# EAGLE design mega (EAGLE 4.16)
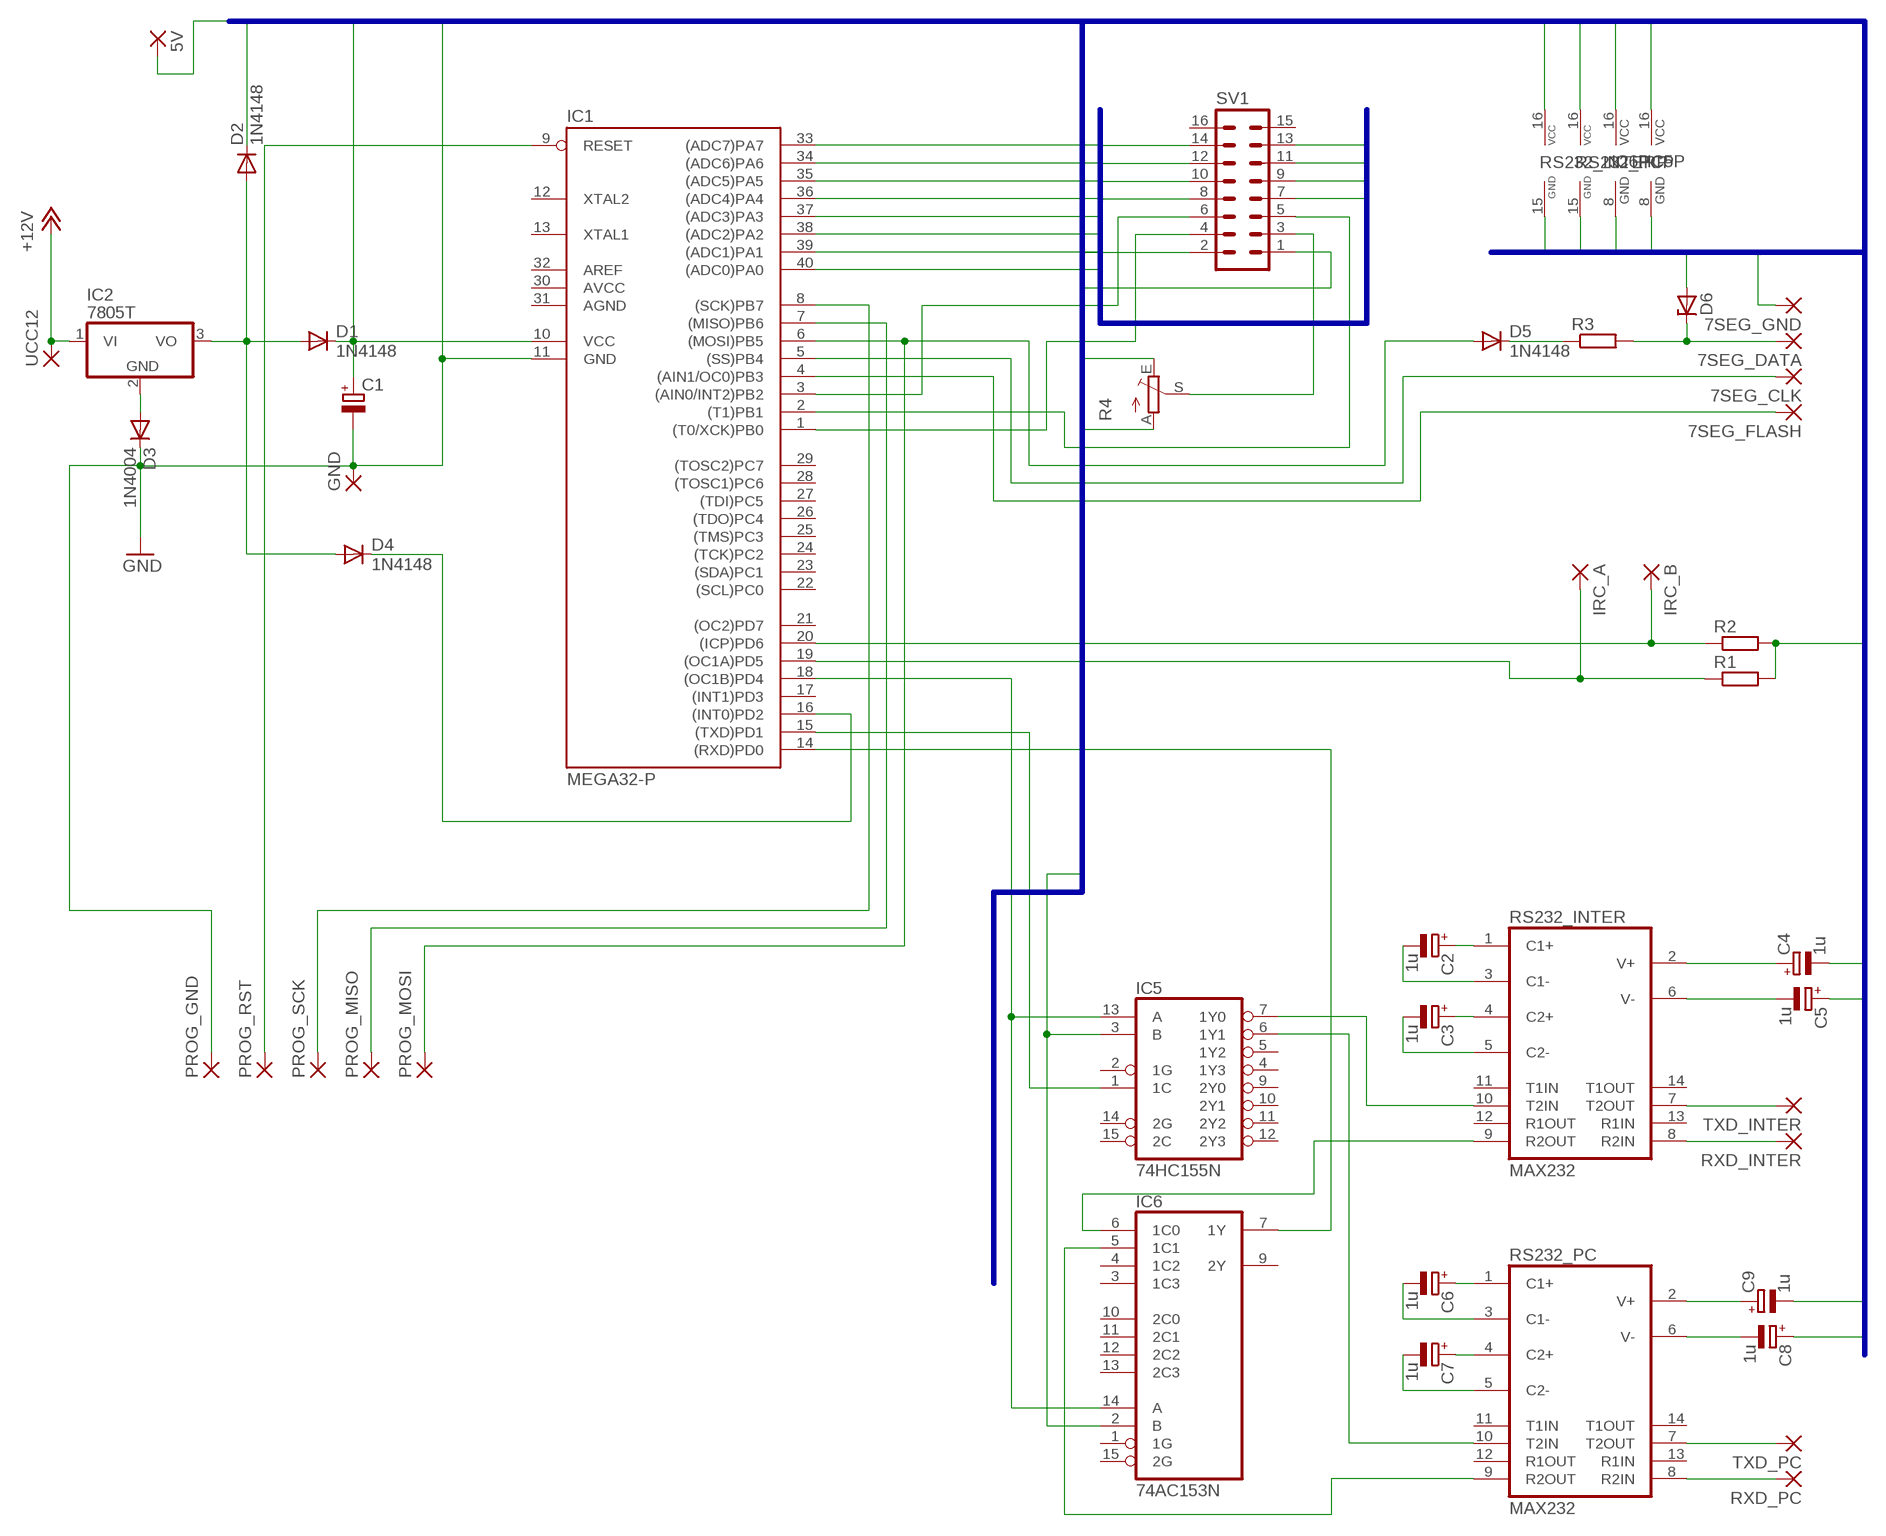
[diagram p0: schematic, sheet 1]

## Parts
5V  2,54/0,8  [2,54/0,8]
7SEG_CLK  2,54/0,8  [2,54/0,8]
7SEG_DATA  2,54/0,8  [2,54/0,8]
7SEG_FLASH  2,54/0,8  [2,54/0,8]
7SEG_GND  2,54/0,8  [2,54/0,8]
C1  CPOL-EUE10-35  [EB35D]
C2  1u  CPOL-EUE2,5-6E  [E2,5-6E]
C3  1u  CPOL-EUE2,5-6E  [E2,5-6E]
C4  1u  CPOL-EUE2,5-6E  [E2,5-6E]
C5  1u  CPOL-EUE2,5-6E  [E2,5-6E]
C6  1u  CPOL-EUE2,5-6E  [E2,5-6E]
C7  1u  CPOL-EUE2,5-6E  [E2,5-6E]
C8  1u  CPOL-EUE2,5-6E  [E2,5-6E]
C9  1u  CPOL-EUE2,5-6E  [E2,5-6E]
D1  1N4148  [DO35-10]
D2  1N4148  [DO35-10]
D3  1N4004  [DO41-10]
D4  1N4148  [DO35-10]
D5  1N4148  [DO35-10]
D6  ZENER-DIODEDO35Z10  [DO35Z10]
GND  2,54/0,8  [2,54/0,8]
IC1  MEGA32-P  [DIL40]
IC2  7805T  [TO220H]
IC5  74HC155N  [DIL16]
IC6  74AC153N  [DIL16]
IRC_A  2,54/0,8  [2,54/0,8]
IRC_B  2,54/0,8  [2,54/0,8]
PROG_GND  2,54/0,8  [2,54/0,8]
PROG_MISO  2,54/0,8  [2,54/0,8]
PROG_MOSI  2,54/0,8  [2,54/0,8]
PROG_RST  2,54/0,8  [2,54/0,8]
PROG_SCK  2,54/0,8  [2,54/0,8]
R1  R-EU_0207/10  [0207/10]
R2  R-EU_0207/10  [0207/10]
R3  R-EU_0207/10  [0207/10]
R4  TRIM_EU-B25U  [B25U]
RS232_INTER  MAX232  [DIL16]
RS232_PC  MAX232  [DIL16]
RXD_INTER  2,54/0,8  [2,54/0,8]
RXD_PC  2,54/0,8  [2,54/0,8]
SV1  ML16  [ML16]
TXD_INTER  2,54/0,8  [2,54/0,8]
TXD_PC  2,54/0,8  [2,54/0,8]
UCC12  2,54/0,8  [2,54/0,8]

## Nets
+12V: IC2.1(VI) UCC12.1(P)
A0: IC1.40((ADC0)PA0) SV1.7
A1: IC1.39((ADC1)PA1) SV1.8
A2: IC1.38((ADC2)PA2) SV1.9
A3: IC1.37((ADC3)PA3) SV1.10
A4: IC1.36((ADC4)PA4) SV1.11
A5: IC1.35((ADC5)PA5) SV1.12
A6: IC1.34((ADC6)PA6) SV1.13
A7: IC1.33((ADC7)PA7) SV1.14
GND: 7SEG_GND.1(P) C1.- C5.+ C8.+ D3.C D6.A GND.1(P) IC1.11(GND) IC5.3(B) IC5.8(GND) IC6.2(B) IC6.8(GND) PROG_GND.1(P) R4.A RS232_INTER.15(GND) RS232_PC.15(GND) SV1.1
N$1: D3.A IC2.2(GND)
N$2: D1.A D2.A D4.A IC2.3(VO)
N$3: IC1.15((TXD)PD1) IC5.1(1C)
N$4: IC1.18((OC1B)PD4) IC5.13(A) IC6.14(A)
N$5: IC1.14((RXD)PD0) IC6.7(1Y)
N$7: IC1.9(RESET) PROG_RST.1(P)
N$8: IC1.8((SCK)PB7) PROG_SCK.1(P)
N$9: IC1.7((MISO)PB6) PROG_MISO.1(P)
N$10: D5.A IC1.6((MOSI)PB5) PROG_MOSI.1(P)
N$11: C9.+ RS232_PC.2(V+)
N$12: C3.+ RS232_INTER.4(C2+)
N$13: C3.- RS232_INTER.5(C2-)
N$14: C2.- RS232_INTER.3(C1-)
N$15: C4.+ RS232_INTER.2(V+)
N$16: C5.- RS232_INTER.6(V-)
N$17: IC5.7(1Y0) RS232_INTER.10(T2IN)
N$18: IC6.6(1C0) RS232_INTER.9(R2OUT)
N$19: RS232_INTER.7(T2OUT) TXD_INTER.1(P)
N$20: RS232_INTER.8(R2IN) RXD_INTER.1(P)
N$21: C8.- RS232_PC.6(V-)
N$22: C6.+ RS232_PC.1(C1+)
N$23: C6.- RS232_PC.3(C1-)
N$24: C7.+ RS232_PC.4(C2+)
N$25: C7.- RS232_PC.5(C2-)
N$26: RS232_PC.7(T2OUT) TXD_PC.1(P)
N$27: RS232_PC.8(R2IN) RXD_PC.1(P)
N$28: IC5.6(1Y1) RS232_PC.10(T2IN)
N$29: IC6.5(1C1) RS232_PC.9(R2OUT)
N$30: IC1.3((AIN0/INT2)PB2) SV1.6
N$31: R4.S SV1.3
N$32: IC1.20((ICP)PD6) IRC_B.1(P) R2.1
N$33: IC1.19((OC1A)PD5) IRC_A.1(P) R1.1
N$34: D4.C IC1.16((INT0)PD2)
N$35: IC1.2((T1)PB1) SV1.5
N$36: IC1.1((T0/XCK)PB0) SV1.4
N$37: D5.C R3.1
N$38: 7SEG_DATA.1(P) D6.C R3.2
N$40: 7SEG_CLK.1(P) IC1.5((SS)PB4)
N$41: 7SEG_FLASH.1(P) IC1.4((AIN1/OC0)PB3)
RS232_INTER: C2.+ RS232_INTER.1(C1+)
UCC5: 5V.1(P) C4.- C9.- D2.C IC5.16(VCC) IC6.16(VCC) R1.2 R2.2 R4.E RS232_INTER.16(VCC) RS232_PC.16(VCC) SV1.2
UCC5_C: C1.+ D1.C IC1.10(VCC)
Unconnected: IC1.12(XTAL2) IC1.13(XTAL1) IC1.17((INT1)PD3) IC1.21((OC2)PD7) IC1.22((SCL)PC0) IC1.23((SDA)PC1) IC1.24((TCK)PC2) IC1.25((TMS)PC3) IC1.26((TDO)PC4) IC1.27((TDI)PC5) IC1.28((TOSC1)PC6) IC1.29((TOSC2)PC7) IC5.2(1G) IC5.4(1Y3) IC5.5(1Y2) IC5.9(2Y0) IC5.10(2Y1) IC5.11(2Y2) IC5.12(2Y3) IC5.14(2G) IC5.15(2C) IC6.1(1G) IC6.3(1C3) IC6.4(1C2) IC6.9(2Y) IC6.10(2C0) IC6.11(2C1) IC6.12(2C2) IC6.13(2C3) IC6.15(2G) RS232_INTER.11(T1IN) RS232_INTER.12(R1OUT) RS232_INTER.13(R1IN) RS232_INTER.14(T1OUT) RS232_PC.11(T1IN) RS232_PC.12(R1OUT) RS232_PC.13(R1IN) RS232_PC.14(T1OUT) SV1.15 SV1.16

## Buses
A[0..7]
UCC5,UCC5_C,GND

## Power pins joined to a net without a drawn wire
AGND: IC1.31(AGND)
AREF: IC1.32(AREF)
AVCC: IC1.30(AVCC)

## Library data of the parts
5V 7SEG_CLK 7SEG_DATA 7SEG_FLASH 7SEG_GND GND IRC_A IRC_B PROG_GND PROG_MISO PROG_MOSI PROG_RST PROG_SCK RXD_INTER RXD_PC TXD_INTER TXD_PC UCC12 = wirepad:2,54/0,8: THROUGH-HOLE PAD
C1-C9 = rcl:CPOL-EU: POLARIZED CAPACITOR, European symbol
D1 D2 D4 D5 = diode:1N4148: DIODE high speed (Philips)
D3 = diode:1N4004: DIODE general purpose rectifier, 1 A
D6 = diode:ZENER-DIODE: Z-Diode
IC1 = atmel:MEGA32-P: MICROCONTROLLER 32 Kbytes FLASH 2 Kbytes SRAM 1 Kbytes EEPROM USART 8-channel 10 bit ADC Source: www.atmel.com .. doc2503.pdf
IC2 = linear:78*: Positive VOLTAGE REGULATOR Source: http://cache.national.com/ds/LM/LM78L05.pdf http://www.fairchildsemi.com/ds/LM/LM7805.pdf
IC5 = 74xx-eu:74*155: Dual 2-line to 4-line data DECODER/DEMULTIPLEXER
IC6 = 74xx-eu:74*153: Dual 4-line to 1-line data SELECTOR/MULTIPLEXER
R1-R3 = rcl:R-EU_: RESISTOR, European symbol
R4 = pot:TRIM_EU-: POTENTIOMETER
RS232_INTER RS232_PC = maxim:MAX232: RS232 TRANSEIVER
SV1 = con-harting-ml:ML16: HARTING

## Board
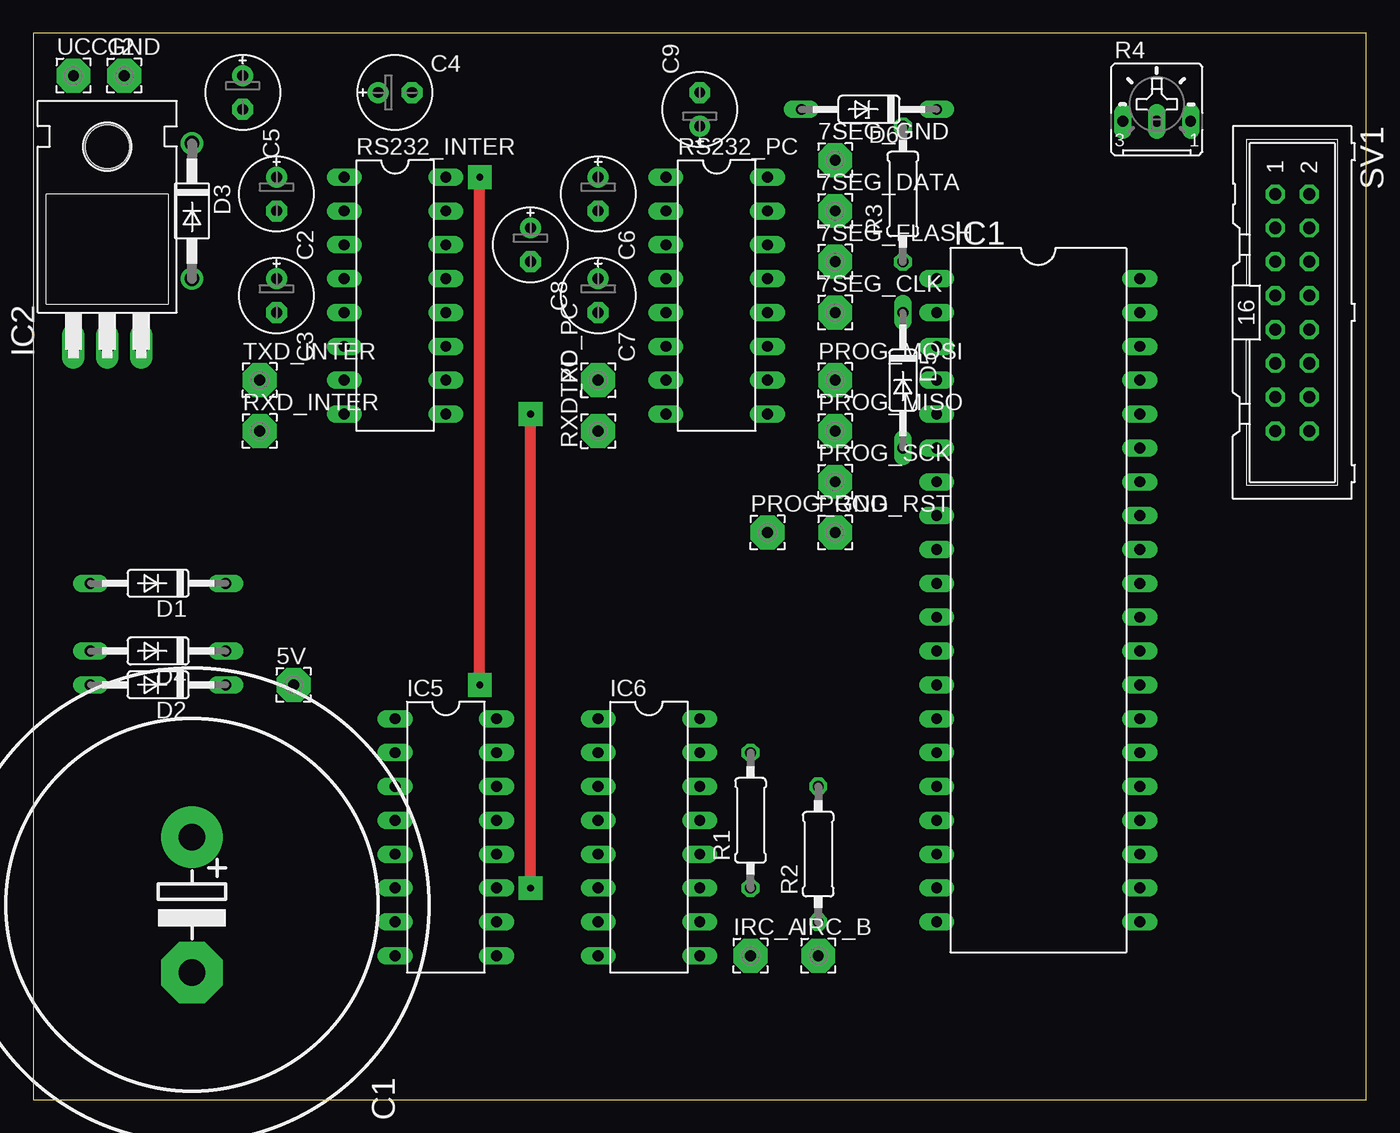
[diagram p1: board, top side]
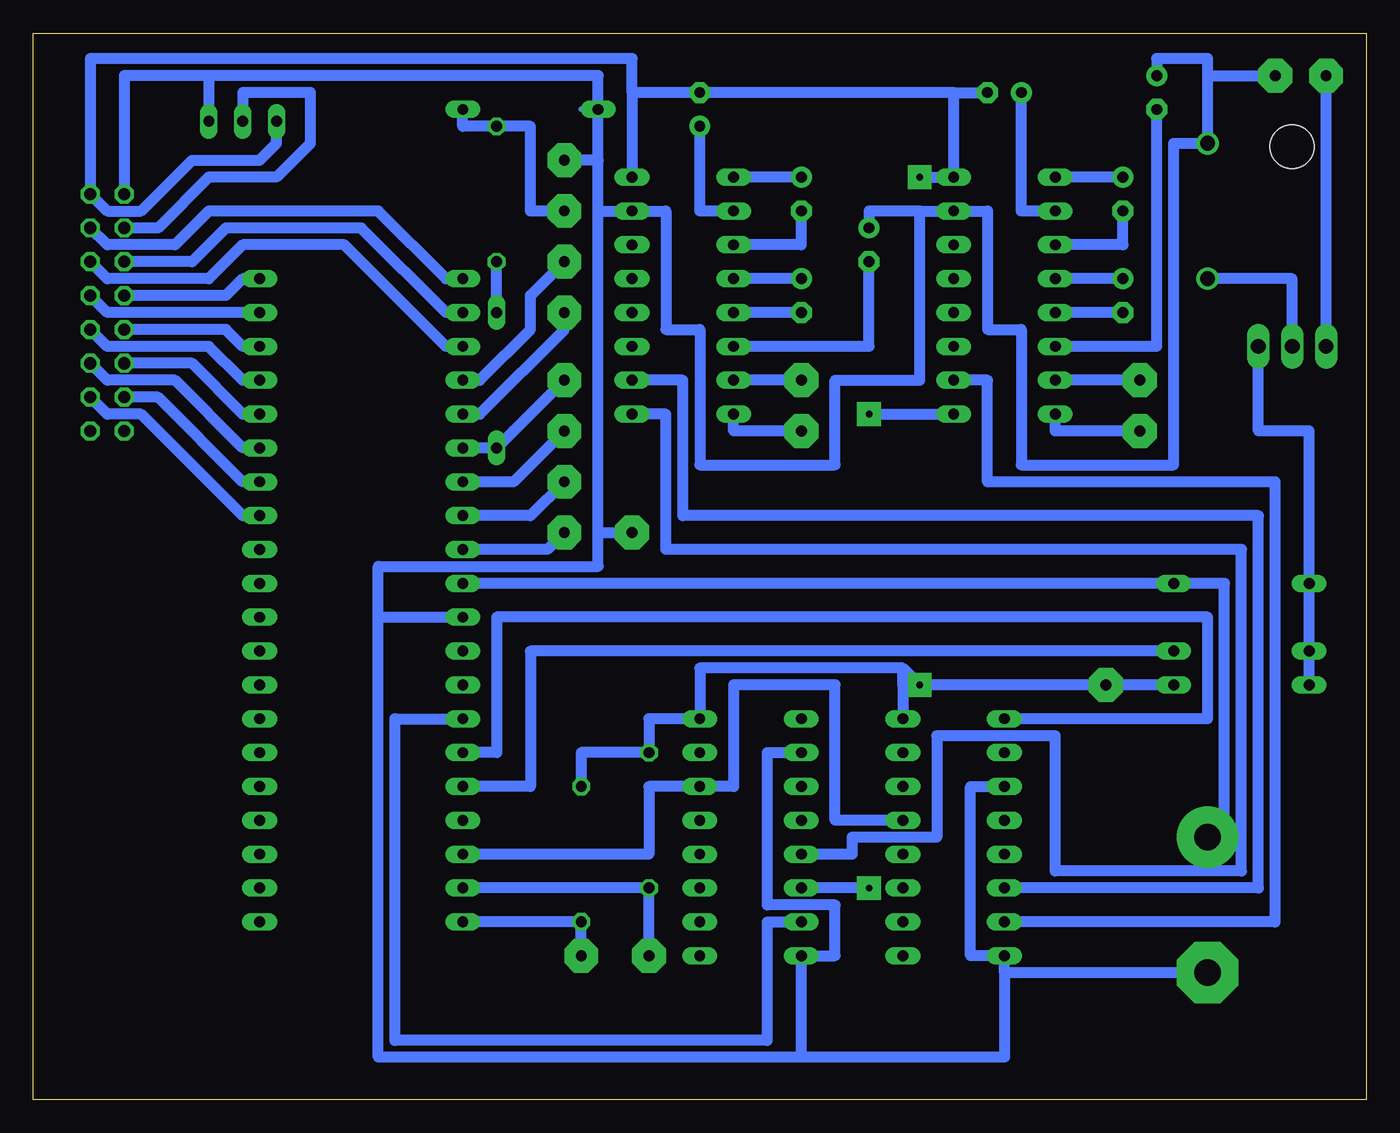
[diagram p2: board, bottom side, seen from below]

Size 100 x 80 mm. Coordinates in mm from the lower left corner, seen from the top.
Outline: 0,0 100,0 100,80 0,80 0,0
Copper layers (1*16): Top 0.035mm / dielectric 1.5mm / Bottom 0.035mm
Design rules "default": minimum track width 10mil, minimum drill 24mil, track to track 8mil, track to pad 8mil, pad to pad 8mil, via to via 8mil, smd to smd 8mil, copper to edge 40mil, drill to drill 8mil, minimum pad ring 10mil, minimum via ring 8mil, stop-mask expansion 4mil, vias tented up to drill 0mil, thermal gap 10mil

### Footprints (pad centres in the part's own frame; a part is rotated, then mirrored left to right if it is on the bottom)
2,54/0,8 = drill 0.813 pad 2.54 octagon: 1 0,0
EB35D = drill 2.007 pad 4.597 round: + -5.08,0 | drill 2.007 pad 4.597 octagon: - 5.08,0
E2,5-6E = drill 0.813 pad 1.575 round: + -1.27,0 | drill 0.813 pad 1.575 octagon: - 1.27,0
DO35-10 = drill 0.813 long: A 5.08,0; C -5.08,0
DO41-10 = drill 1.118 round: A 5.08,0; C -5.08,0
DO35Z10 = drill 0.813 long: A 5.08,0; C -5.08,0
DIL40 = drill 0.813 long: 1 -24.13,-7.62; 2 -21.59,-7.62; 3 -19.05,-7.62; 4 -16.51,-7.62; 5 -13.97,-7.62; 6 -11.43,-7.62; 7 -8.89,-7.62; 8 -6.35,-7.62; 9 -3.81,-7.62; 10 -1.27,-7.62; 11 1.27,-7.62; 12 3.81,-7.62; 13 6.35,-7.62; 14 8.89,-7.62; 15 11.43,-7.62; 16 13.97,-7.62; 17 16.51,-7.62; 18 19.05,-7.62; 19 21.59,-7.62; 20 24.13,-7.62; 21 24.13,7.62; 22 21.59,7.62; 23 19.05,7.62; 24 16.51,7.62; 25 13.97,7.62; 26 11.43,7.62; 27 8.89,7.62; 28 6.35,7.62; 29 3.81,7.62; 30 1.27,7.62; 31 -1.27,7.62; 32 -3.81,7.62; 33 -6.35,7.62; 34 -8.89,7.62; 35 -11.43,7.62; 36 -13.97,7.62; 37 -16.51,7.62; 38 -19.05,7.62; 39 -21.59,7.62; 40 -24.13,7.62
TO220H = drill 1.118 long: 1 -2.54,-10.16; 2 0,-10.16; 3 2.54,-10.16 | hole 3.302: 0,4.826
DIL16 = drill 0.813 long: 1 -8.89,-3.81; 2 -6.35,-3.81; 3 -3.81,-3.81; 4 -1.27,-3.81; 5 1.27,-3.81; 6 3.81,-3.81; 7 6.35,-3.81; 8 8.89,-3.81; 9 8.89,3.81; 10 6.35,3.81; 11 3.81,3.81; 12 1.27,3.81; 13 -1.27,3.81; 14 -3.81,3.81; 15 -6.35,3.81; 16 -8.89,3.81
0207/10 = drill 0.813 octagon: 1 -5.08,0; 2 5.08,0
B25U = drill 0.813 long: A 2.54,-0.889; E -2.54,-0.889; S 0,-0.889
ML16 = drill 0.914 octagon: 1 -8.89,-1.27; 2 -8.89,1.27; 3 -6.35,-1.27; 4 -6.35,1.27; 5 -3.81,-1.27; 6 -3.81,1.27; 7 -1.27,-1.27; 8 -1.27,1.27; 9 1.27,-1.27; 10 1.27,1.27; 11 3.81,-1.27; 12 3.81,1.27; 13 6.35,-1.27; 14 6.35,1.27; 15 8.89,-1.27; 16 8.89,1.27

### Placement (x,y rotation side)
5V  19.52,31.11 0 top
7SEG_CLK  60.16,59.05 0 top
7SEG_DATA  60.16,66.67 0 top
7SEG_FLASH  60.16,62.86 0 top
7SEG_GND  60.16,70.48 0 top
C1  11.9,14.6 270 top
C2  18.25,67.94 270 top
C3  18.25,60.32 270 top
C4  27.14,75.56 0 top
C5  15.71,75.56 270 top
C6  42.38,67.94 270 top
C7  42.38,60.32 270 top
C8  37.3,64.13 270 top
C9  50,74.29 90 top
D1  9.36,38.73 180 top
D2  9.36,31.11 180 top
D3  11.9,66.67 270 top
D4  9.36,33.65 180 top
D5  65.24,53.97 270 top
D6  62.7,74.29 180 top
GND  6.82,76.83 0 top
IC1  75.4,37.46 270 top
IC2  5.55,66.67 0 top
IC5  30.95,19.68 270 top
IC6  46.19,19.68 270 top
IRC_A  53.81,10.79 0 top
IRC_B  58.89,10.79 0 top
PROG_GND  55.08,42.54 0 top
PROG_MISO  60.16,50.16 0 top
PROG_MOSI  60.16,53.97 0 top
PROG_RST  60.16,42.54 0 top
PROG_SCK  60.16,46.35 0 top
R1  53.81,20.95 90 top
R2  58.89,18.41 90 top
R3  65.24,67.94 90 top
R4  84.29,74.29 0 top
RS232_INTER  27.14,60.32 270 top
RS232_PC  51.27,60.32 270 top
RXD_INTER  16.98,50.16 0 top
RXD_PC  42.38,50.16 90 top
SV1  94.45,59.05 270 top
TXD_INTER  16.98,53.97 0 top
TXD_PC  42.38,53.97 90 top
UCC12  3.01,76.83 0 top

### Tracks (layer width: path | path; a pad name or v marks a point on that pad's centre or on a via)
+12V
  Bottom 0.813: IC2.1 UCC12.1
A0
  Bottom 0.813: SV1.7 85.56,60.32 84.29,61.59 IC1.40
A1
  Bottom 0.813: SV1.8 94.45,59.05 IC1.39
A2
  Bottom 0.813: IC1.38 84.29,56.51 85.56,57.78 SV1.9
A3
  Bottom 0.813: IC1.37 84.29,53.97 86.83,56.51 94.45,56.51 SV1.10
A4
  Bottom 0.813: IC1.36 84.29,51.43 88.1,55.24 SV1.11
A5
  Bottom 0.813: IC1.35 84.29,48.89 89.37,53.97 94.45,53.97 SV1.12
A6
  Bottom 0.813: IC1.34 84.29,46.35 90.64,52.7 SV1.13
A7
  Bottom 0.813: IC1.33 84.29,43.81 91.91,51.43 94.45,51.43 SV1.14
GND
  Bottom 0.406: D6.A 58.89,74.29
  Bottom 0.813: 11.9,76.83 GND.1 | 11.9,76.83 D3.C 14.44,71.75 14.44,47.62 25.87,47.62 25.87,57.78 28.41,57.78 28.41,66.67 RS232_INTER.15 33.49,66.67 | 11.9,76.83 11.9,78.1 15.71,78.1 C5.+ | C1.- 27.14,9.52 | 27.14,9.52 IC5.8 29.68,10.79 29.68,23.49 IC5.3 | 33.49,66.67 37.3,66.67 C8.+ | 74.13,36.19 74.13,3.17 42.38,3.17 | 74.13,36.19 IC1.11 | 74.13,36.19 74.13,40 57.62,40 57.62,42.54 | 57.62,66.67 RS232_PC.15 52.54,66.67 52.54,57.78 50,57.78 50,47.62 39.84,47.62 39.84,53.97 33.49,53.97 33.49,66.67 | 57.62,42.54 57.62,66.67 | IC6.2 44.92,26.03 44.92,14.6 39.84,14.6 39.84,10.79 IC6.8 42.38,3.17 | 42.38,3.17 27.14,3.17 27.14,9.52 | SV1.1 93.18,76.83 86.83,76.83 | 86.83,76.83 R4.A | 57.62,66.67 57.62,70.48 | 57.62,70.48 D6.A 57.62,76.83 86.83,76.83 | 57.62,42.54 PROG_GND.1 | 57.62,70.48 7SEG_GND.1
N$1
  Bottom 0.813: IC2.2 5.55,61.59 D3.A
N$2
  Bottom 0.813: IC2.3 8.09,50.16 4.28,50.16 D1.A D4.A D2.A
N$3
  Bottom 0.813: IC5.1 11.9,28.57 11.9,36.19 65.24,36.19 65.24,26.03 IC1.15
N$4
  Bottom 0.813: IC5.13 39.84,20.95 39.84,31.11 47.46,31.11 47.46,23.49 IC6.14 53.81,23.49 53.81,18.41 IC1.18
N$5
  Bottom 0.813: IC1.14 72.86,28.57 72.86,4.44 44.92,4.44 44.92,13.33 IC6.7
N$7
  Bottom 0.813: PROG_RST.1 61.43,41.27 IC1.9
N$8
  Bottom 0.813: IC1.8 62.7,43.81 PROG_SCK.1
N$9
  Bottom 0.813: IC1.7 63.97,46.35 PROG_MISO.1
N$10
  Bottom 0.813: IC1.6 D5.A 63.97,50.16 PROG_MOSI.1
N$11
  Bottom 0.813: RS232_PC.2 50,66.67 C9.+
N$12
  Bottom 0.813: C3.+ RS232_INTER.4
N$13
  Bottom 0.813: C3.- RS232_INTER.5
N$14
  Bottom 0.813: RS232_INTER.3 18.25,64.13 C2.-
N$15
  Bottom 0.813: RS232_INTER.2 25.87,66.67 C4.+
N$16
  Bottom 0.813: RS232_INTER.6 15.71,56.51 C5.-
N$17
  Bottom 0.813: RS232_INTER.10 28.41,53.97 28.41,46.35 6.82,46.35 6.82,13.33 IC5.7
N$18  (via drill 0.5 pad 1.78)
  Top 0.813: v37.3,15.87 v37.3,51.43
  Bottom 0.813: v37.3,51.43 RS232_INTER.9 | v37.3,15.87 IC6.6
N$19
  Bottom 0.813: TXD_INTER.1 RS232_INTER.7
N$20
  Bottom 0.813: RS232_INTER.8 23.33,50.16 RXD_INTER.1
N$21
  Bottom 0.813: C8.- 37.3,56.51 RS232_PC.6
N$22
  Bottom 0.813: C6.+ RS232_PC.1
N$23
  Bottom 0.813: RS232_PC.3 42.38,64.13 C6.-
N$24
  Bottom 0.813: C7.+ RS232_PC.4
N$25
  Bottom 0.813: C7.- RS232_PC.5
N$26
  Bottom 0.813: TXD_PC.1 RS232_PC.7
N$27
  Bottom 0.813: RXD_PC.1 47.46,50.16 RS232_PC.8
N$28
  Bottom 0.813: IC5.6 8.09,15.87 8.09,43.81 51.27,43.81 51.27,53.97 RS232_PC.10
N$29
  Bottom 0.813: IC6.5 38.57,18.41 38.57,19.68 32.22,19.68 32.22,27.3 23.33,27.3 23.33,17.14 9.36,17.14 9.36,41.27 52.54,41.27 52.54,51.43 RS232_PC.9
N$30
  Bottom 0.813: SV1.6 94.45,61.59 86.83,61.59 84.29,64.13 76.67,64.13 69.05,56.51 IC1.3
N$31
  Bottom 0.813: R4.S 84.29,75.56 79.21,75.56 79.21,71.75 81.75,69.21 86.83,69.21 90.64,65.4 SV1.3
N$32
  Bottom 0.813: IRC_B.1 R2.1 IC1.20
N$33
  Bottom 0.813: IRC_A.1 R1.1 IC1.19
N$34
  Bottom 0.813: D4.C 62.7,33.65 62.7,23.49 IC1.16
N$35
  Bottom 0.813: SV1.5 88.1,62.86 85.56,65.4 75.4,65.4 69.05,59.05 IC1.2
N$36
  Bottom 0.813: IC1.1 69.05,61.59 74.13,66.67 86.83,66.67 89.37,64.13 94.45,64.13 SV1.4
N$37
  Bottom 0.813: D5.C R3.1
N$38
  Bottom 0.813: D6.C 67.78,73.02 R3.2 62.7,73.02 62.7,66.67 7SEG_DATA.1
N$40
  Bottom 0.813: IC1.5 66.51,51.43 60.16,57.78 7SEG_CLK.1
N$41
  Bottom 0.813: IC1.4 66.51,53.97 62.7,57.78 62.7,60.32 7SEG_FLASH.1
RS232_INTER
  Bottom 0.813: C2.+ RS232_INTER.1
UCC5  (via drill 0.5 pad 1.78)
  Top 0.813: v33.49,31.11 v33.49,69.21
  Bottom 0.813: 30.95,75.56 RS232_INTER.16 v33.49,69.21 | 30.95,75.56 C4.- | 55.08,75.56 C9.- 30.95,75.56 | 55.08,75.56 RS232_PC.16 | 34.76,32.38 50,32.38 IC6.16 53.81,28.57 R1.2 58.89,26.03 R2.2 | 34.76,31.11 IC5.16 | 34.76,31.11 34.76,32.38 | 55.08,75.56 55.08,78.1 95.72,78.1 SV1.2 94.45,66.67 91.91,66.67 88.1,70.48 83.02,70.48 81.75,71.75 R4.E | 34.76,32.38 v33.49,31.11 | D2.C 5V.1 34.76,31.11
UCC5_C
  Bottom 0.813: 60.16,38.73 IC1.10 | 60.16,38.73 63.97,38.73 | C1.+ 10.63,19.68 10.63,38.73 D1.C 60.16,38.73